# EAGLE design m328p_rfm69_node (EAGLE 7.2.0)
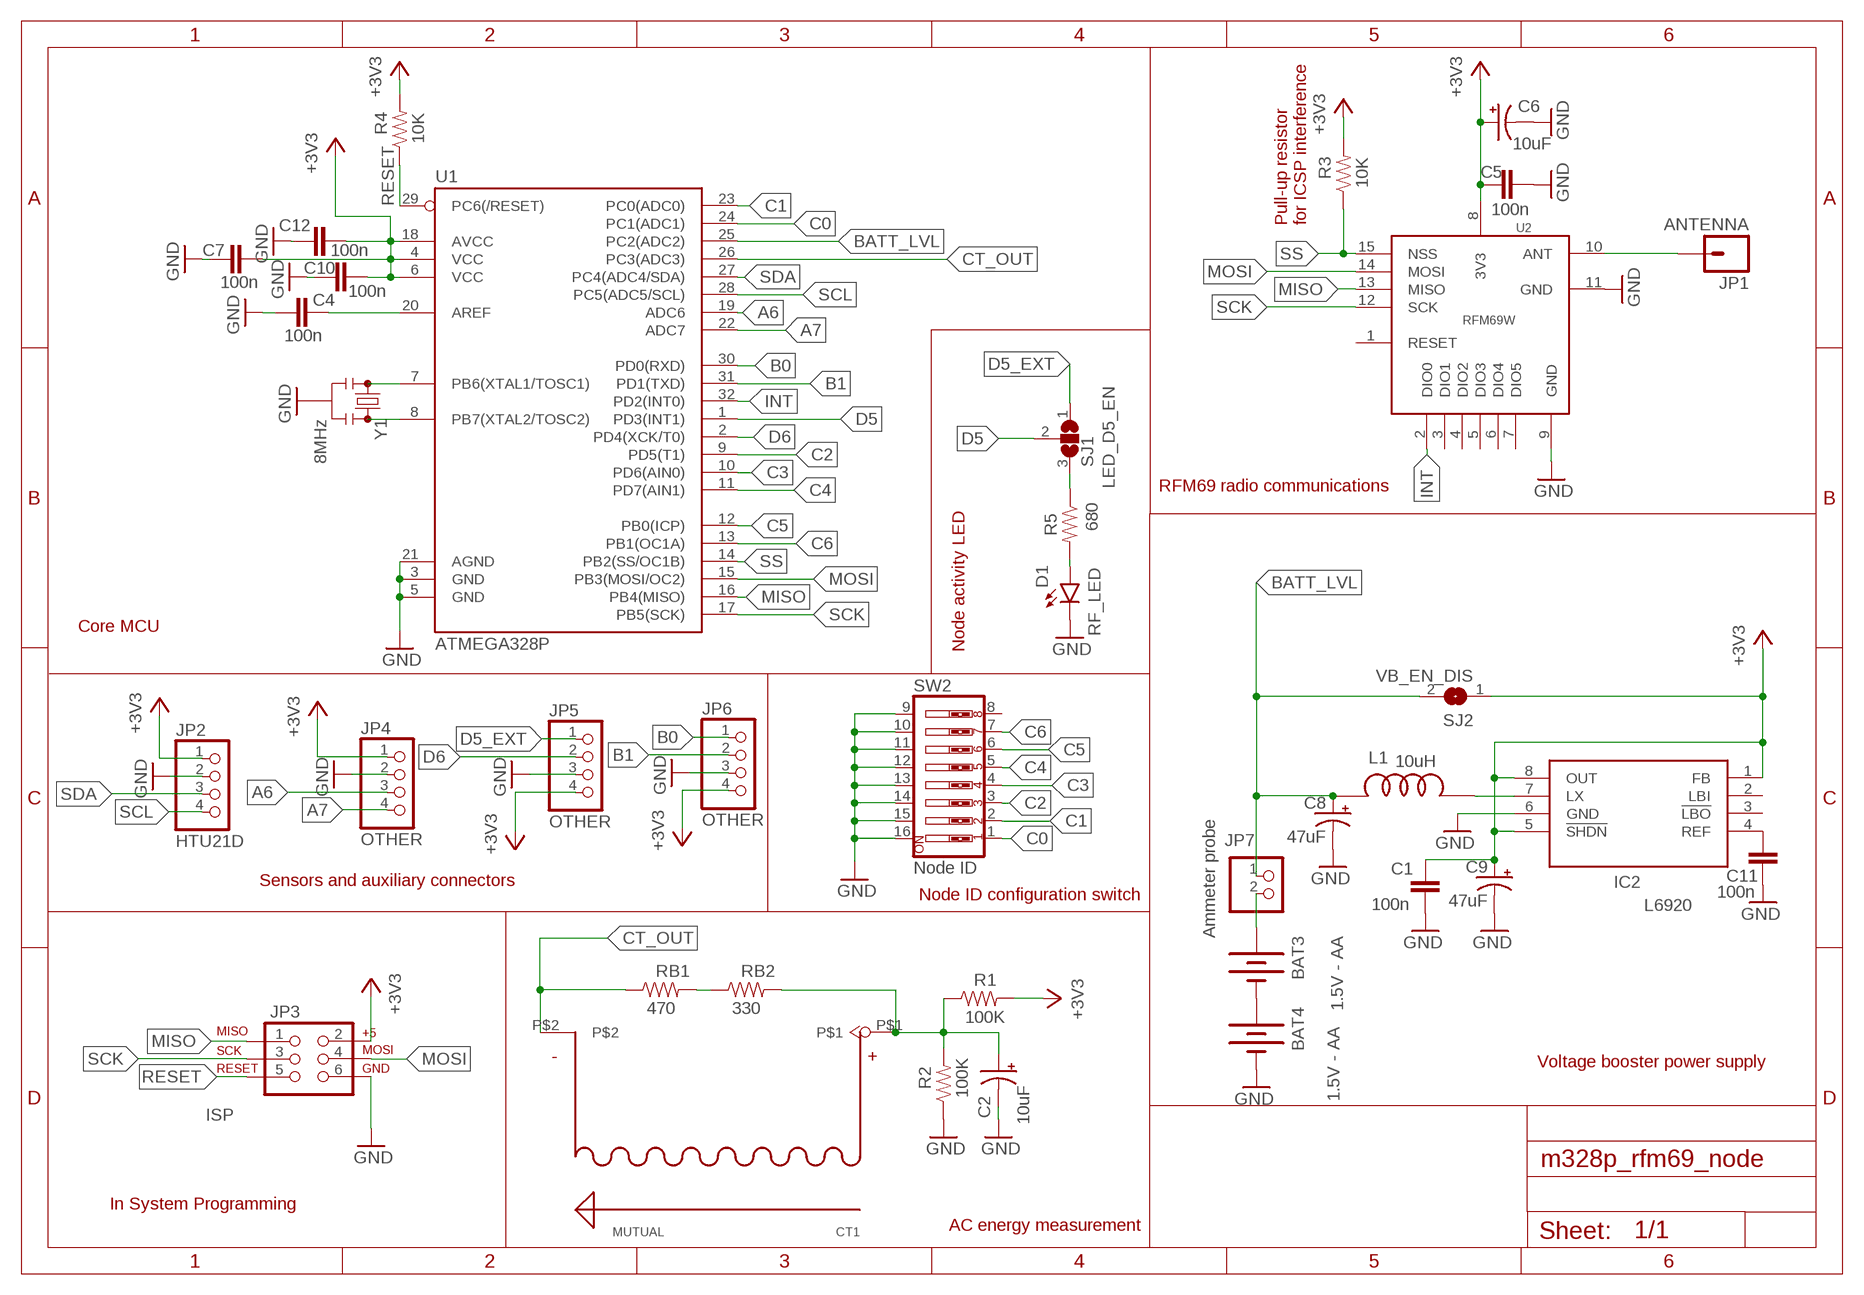
[diagram p0: schematic, sheet 1]

## Parts
BAT3  1.5V - AA  BATTERYAAA-KIT  [BATTERY-AAA-KIT]
BAT4  1.5V - AA  BATTERYAAA-KIT  [BATTERY-AAA-KIT]
C1  100n  CAP0805  [0805]
C2  10uF  47UF-TANT  [EIA3528]
C4  100n  CAP0805  [0805]
C5  100n  CAP0805  [0805]
C6  10uF  47UF-TANT  [EIA3528]
C7  100n  CAP0805  [0805]
C8  47uF  47UF-TANT  [EIA3528]
C9  47uF  47UF-TANT  [EIA3528]
C10  100n  CAP0805  [0805]
C11  100n  CAP0805  [0805]
C12  100n  CAP0805  [0805]
CT1  MUTUAL  [MUTUAL]
D1  RF_LED  LED0603  [LED-0603]
IC2  L6920  L6920TSSOP8  [TSSOP8]
JP1  ANTENNA  M01SMD  [LUXEON-PAD]
JP2  HTU21D  PINHD-1X4  [1X04]
JP3  ISP  AVR_SPI_PRG_6PTH  [2X3]
JP4  OTHER  PINHD-1X4  [1X04]
JP5  OTHER  PINHD-1X4  [1X04]
JP6  OTHER  PINHD-1X4  [1X04]
JP7  Ammeter probe  PINHD-1X2  [1X02]
L1  10uH  DLJ-4018  [DLJ-4018]
R1  100K  RESISTOR0805-RES  [0805]
R2  100K  RESISTOR0805-RES  [0805]
R3  10K  RESISTOR0805-RES  [0805]
R4  10K  RESISTOR0805-RES  [0805]
R5  680  RESISTOR0805-RES  [0805]
RB1  470  RESISTOR0805-RES  [0805]
RB2  330  RESISTOR0805-RES  [0805]
SJ1  LED_D5_EN  SJ2W  [SJ_2]
SJ2  VB_EN_DIS  SJ  [SJ]
SW2  Node ID  SW_DIP-8-SMT-HALFSIZE  [DIPSWITCH-08-50MIL]
U1  ATMEGA328P  ATMEGA328P_TQFP  [TQFP32-08]
U2  RFM69W  [RFM69W]
Y1  8MHz  RESONATOR4MHZ  [RESONATOR-SMD_MED]

## Nets
+3V3: C1.1 C5.1 C6.A(+) C7.2 C9.A(+) C10.2 C12.2 IC2.1(FB) IC2.5(!SHDN) IC2.8(OUT) JP2.1 JP3.2 JP4.1 JP5.4 JP6.4 R1.2 R3.2 R4.2 SJ2.1 U1.4(VCC) U1.6(VCC) U1.18(AVCC) U2.8(3V3)
A6: JP4.3 U1.19(ADC6)
A7: JP4.4 U1.22(ADC7)
B0: JP6.1 U1.30(PD0(RXD))
B1: JP6.2 U1.31(PD1(TXD))
BATT_LVL: C8.A(+) JP7.1 L1.P$2 SJ2.2 U1.25(PC2(ADC2))
C0: SW2.1 U1.24(PC1(ADC1))
C1: SW2.2 U1.23(PC0(ADC0))
C2: SW2.3 U1.9(PD5(T1))
C3: SW2.4 U1.10(PD6(AIN0))
C4: SW2.5 U1.11(PD7(AIN1))
C5: SW2.6 U1.12(PB0(ICP))
C6: SW2.7 U1.13(PB1(OC1A))
CT_OUT: CT1.P$2 RB1.1 U1.26(PC3(ADC3))
D5: SJ1.2 U1.1(PD3(INT1))
D5_EXT: JP5.1 SJ1.1
D6: JP5.2 U1.2(PD4(XCK/T0))
GND: BAT4.GND@1(-) C1.2 C2.C(-) C4.1 C5.2 C6.C(-) C7.1 C8.C(-) C9.C(-) C10.1 C11.2 C12.1 D1.C IC2.6(GND) JP2.2 JP3.6 JP4.2 JP5.3 JP6.3 R2.1 SW2.9 SW2.10 SW2.11 SW2.12 SW2.13 SW2.14 SW2.15 SW2.16 U1.3(GND) U1.5(GND) U1.21(AGND) U2.9(GND) U2.11(GND) Y1.2
INT: U1.32(PD2(INT0)) U2.2(DIO0)
MISO: JP3.1 U1.16(PB4(MISO)) U2.13(MISO)
MOSI: JP3.4 U1.15(PB3(MOSI/OC2)) U2.14(MOSI)
N$1: IC2.7(LX) L1.P$1
N$2: D1.A R5.2
N$3: RB1.2 RB2.1
N$4: C11.1 IC2.4(REF)
N$5: BAT3.PWR@1(+) JP7.2
N$6: U1.8(PB7(XTAL2/TOSC2)) Y1.3
N$8: BAT3.GND@1(-) BAT4.PWR@1(+)
N$9: U1.7(PB6(XTAL1/TOSC1)) Y1.1
N$10: JP1.P$1 U2.10(ANT)
N$11: C2.A(+) CT1.P$1 R1.1 R2.2 RB2.2
N$12: C4.2 U1.20(AREF)
N$13: R5.1 SJ1.3
RESET: JP3.5 R4.1 U1.29(PC6(/RESET))
SCK: JP3.3 U1.17(PB5(SCK)) U2.12(SCK)
SCL: JP2.4 U1.28(PC5(ADC5/SCL))
SDA: JP2.3 U1.27(PC4(ADC4/SDA))
SS: R3.1 U1.14(PB2(SS/OC1B)) U2.15(NSS)
Unconnected: IC2.2(LBI) IC2.3(!LBO) SW2.8 U2.1(RESET) U2.3(DIO1) U2.4(DIO2) U2.5(DIO3) U2.6(DIO4) U2.7(DIO5)

## Notes on the sheet
- Pull-up resistor
  for ICSP interference
- RFM69 radio communications
- Core MCU
- Node activity LED
- Sensors and auxiliary connectors
- Node ID configuration switch
- Voltage booster power supply
- In System Programming
- AC energy measurement

## Library data of the parts
BAT3 BAT4 = SparkFun-Electromechanical:BATTERY: Battery Holders Various common sizes : AA, AAA, 18650 (PRT-12895), 20mm coin cell and 12mm coin cell. 20MM_4LEGS, BATT-10373; PROD_ID: BATT-08571
C1 C4 C5 C7 C10-C12 = SparkFun-Capacitors:CAP: Capacitor Standard 0603 ceramic capacitor, and 0.1" leaded capacitor.
C2 C6 = SparkFun-Capacitors:47UF-TANT: 47uF Tantalum SMT CAP-08310- 10V 10% (EIA-3528); PROD_ID: CAP-08310; VALUE: 47uF
C8 C9 = SparkFun-Capacitors:47UF-TANT: 47uF Tantalum SMT CAP-08310- 10V 10% (EIA-3528); PROD_ID: CAP-08310
CT1 = Electricity_sensor:MUTUAL
D1 = SparkFun-LED:LED: LEDs Standard schematic elements and footprints for 5mm, 3mm, 1206, and 0603 sized LEDs. 5mm - Spark Fun Electronics SKU : COM-00529 (and others)
IC2 = l6920:L6920
JP1 = SparkFun-Connectors:M01: Header 1 Standard 1-pin 0.1" header. Use with straight break away headers (SKU : PRT-00116), right angle break away headers (PRT-00553), swiss pins (PRT-00743), machine pins (PRT-00117), and female headers (PRT-00115).
JP2 JP4-JP6 = pinhead:PINHD-1X4: PIN HEADER
JP3 = SparkFun-Connectors:AVR_SPI_PRG_6: AVR ISP 6 Pin This is the reduced ISP connector for AVR programming. Common on Arduino. This footprint will take up less PCB space and can be used with a 10-pin to 6-pin adapter such as SKU: BOB-08508 **Special note about "TEST_POINT" package. The stop mask is on the top side, so if you want your programming test points to be on the bottom of your board, make sure to place this package on the bottom side of the board. This also ensure that the orientation to program from the bottom side will be correct.
JP7 = pinhead:PINHD-1X2: PIN HEADER
L1 = dlj-4018:DLJ-4018
R1-R4 RB1 RB2 = SparkFun-Resistors:RESISTOR: Resistor Basic schematic elements and footprints for 0603, 1206, and PTH resistors.
R5 = SparkFun-Passives:RESISTOR: Resistor Basic schematic elements and footprints for 0603, 1206, and PTH resistors.
SJ1 = jumper:SJ2W: SMD solder JUMPER
SJ2 = jumper:SJ: SMD solder JUMPER
SW2 = SparkFun-Electromechanical:SW_DIP-8: DIP Switch 8 Position
U1 = SparkFun-DigitalIC:ATMEGA328P_TQFP; PROD_ID: IC-09069; VALUE: ATMEGA328P_TQFP
U2 = rfm69w:RFM69W: Radio Transceiver Module, FSK, 433, 848, 915 MHz, SPI controlled, Mfr=HopeRF
Y1 = SparkFun-FreqCtrl:RESONATOR: Resonator Small SMD resonator. Used, eg, on the Arduino Pro/ Pro Mini boards. 8MHz- XTAL-08895 16MHz- XTAL-08900; PROD_ID: XTAL-12492; VALUE: 4MHz

## Board
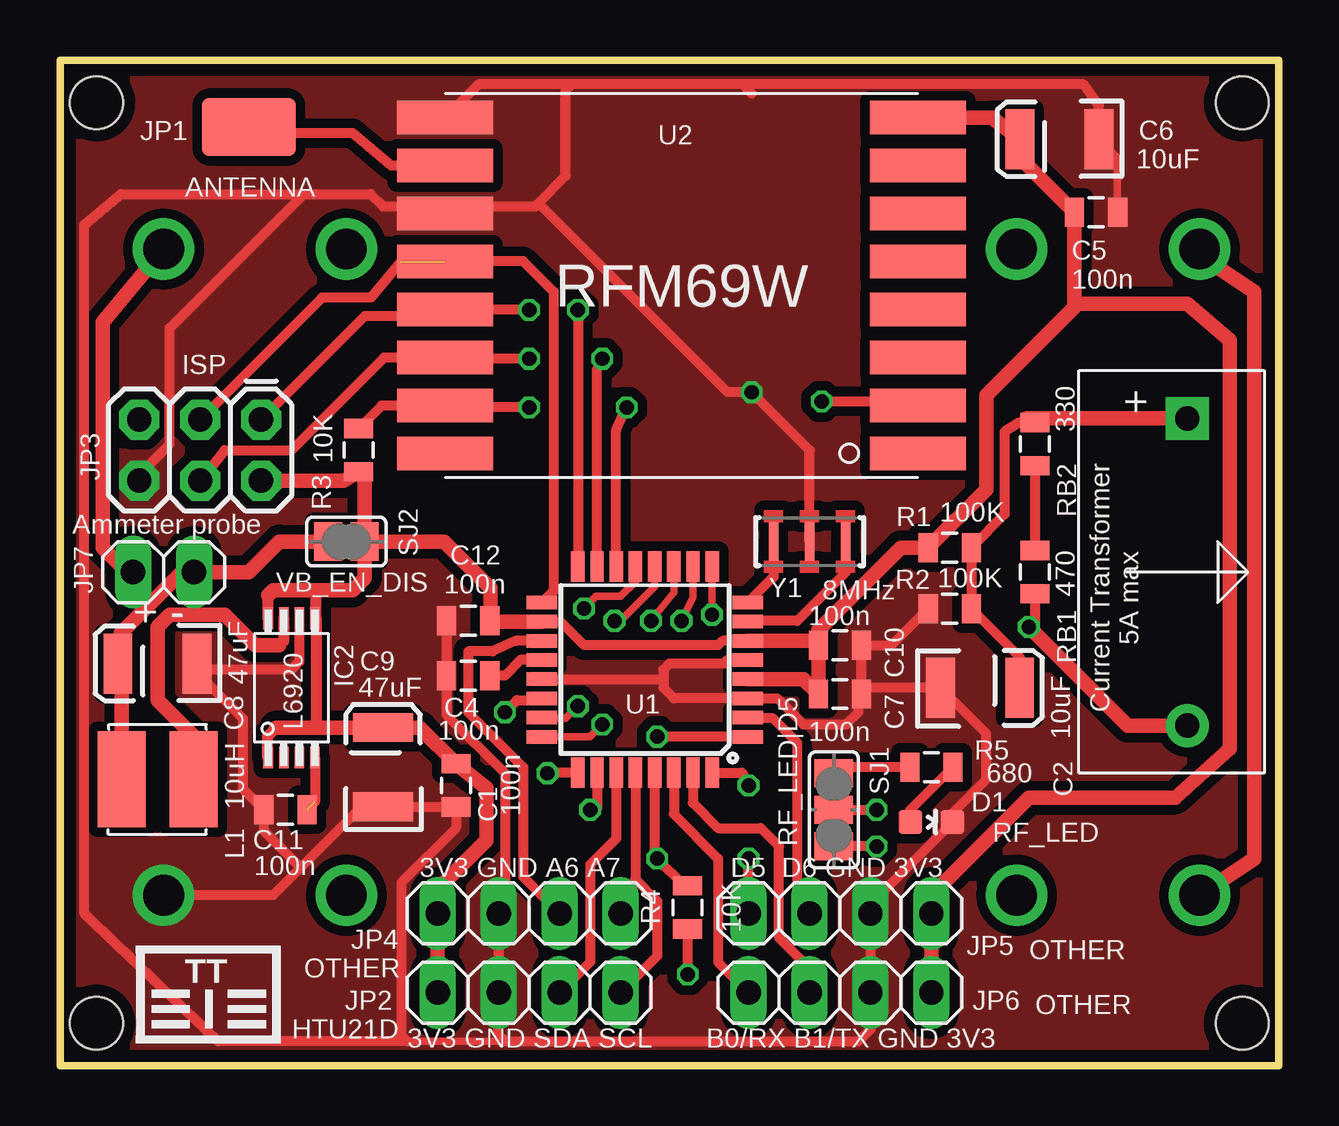
[diagram p1: board, top side]
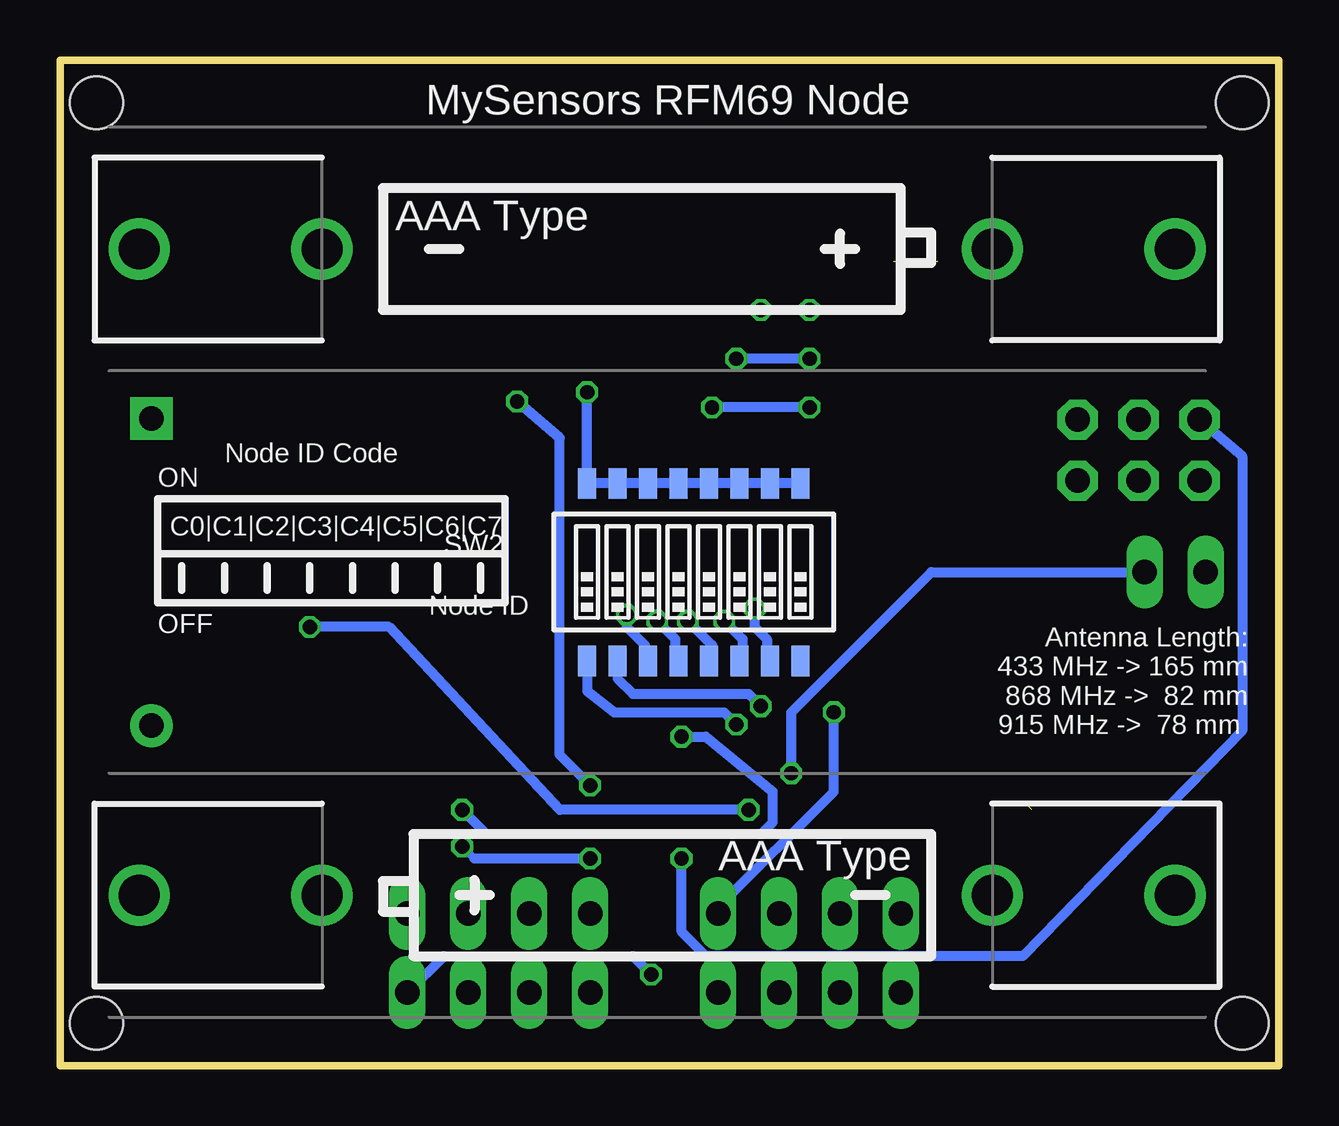
[diagram p2: board, bottom side, seen from below]

Size 50.8 x 41.91 mm. Coordinates in mm from the lower left corner, seen from the top.
Outline: 0,41.91 50.8,41.91 50.8,0 0,0 0,41.91
Copper layers (1*16): Top 0.035mm / dielectric 1.5mm / Bottom 0.035mm
Design rules "smart-proto *": minimum track width 7mil, minimum drill 12mil, track to track 7mil, track to pad 7mil, pad to pad 7mil, via to via 7mil, smd to smd 0mil, copper to edge 20mil, drill to drill 10mil, minimum pad ring 10mil, minimum via ring 6mil, stop-mask expansion 2mil, vias tented up to drill 25mil, thermal gap 10mil
Holes 2.2 mm at 1.52,40.13 1.52,1.78 49.28,1.78 49.28,40.13

### Footprints (pad centres in the part's own frame; a part is rotated, then mirrored left to right if it is on the bottom)
BATTERY-AAA-KIT = drill 1.702: GND@1 21.59,0; GND@2 13.97,0; PWR@1 -21.59,0; PWR@2 -13.97,0
0805 = smd 0.8 x 1.2: 1 -0.9,0; 2 0.9,0
EIA3528 = smd 1.2 x 2.5: A 1.65,0; C -1.65,0
MUTUAL = drill 1.016 pad 1.778 square: P$1 -6.4,0 | drill 1.016 pad 1.778: P$2 6.4,0
LED-0603 = smd 1 x 1: A 0,-0.877; C 0,0.877
TSSOP8 = smd 0.4 x 0.9: 1 -0.975,-2.9; 2 -0.325,-2.9; 3 0.325,-2.9; 4 0.975,-2.9; 5 0.975,2.9; 6 0.325,2.9; 7 -0.325,2.9; 8 -0.975,2.9
LUXEON-PAD = smd 3.9 x 2.4: P$1 0,0
1X04 = drill 1.016 long: 1 -3.81,0; 2 -1.27,0; 3 1.27,0; 4 3.81,0
2X3 = drill 1.016 pad 1.676 octagon: 1 -2.54,-1.27; 2 -2.54,1.27; 3 0,-1.27; 4 0,1.27; 5 2.54,-1.27; 6 2.54,1.27
1X02 = drill 1.016 long: 1 -1.27,0; 2 1.27,0
DLJ-4018 = smd 4 x 2: P$1 0,-1.5; P$2 0,1.5
SJ_2 = smd 1.168 x 1.6: 1 -1.524,0; 2 0,0; 3 1.524,0
SJ = smd 1.168 x 1.6: 1 -0.762,0; 2 0.762,0
DIPSWITCH-08-50MIL = smd 0.762 x 1.27: 1 -4.445,-3.7; 2 -3.175,-3.7; 3 -1.905,-3.7; 4 -0.635,-3.7; 5 0.635,-3.7; 6 1.905,-3.7; 7 3.175,-3.7; 8 4.445,-3.7; 9 4.445,3.7; 10 3.175,3.7; 11 1.905,3.7; 12 0.635,3.7; 13 -0.635,3.7; 14 -1.905,3.7; 15 -3.175,3.7; 16 -4.445,3.7
TQFP32-08 = smd 1.27 x 0.559: 1 -4.293,2.8; 2 -4.293,2; 3 -4.293,1.2; 4 -4.293,0.4; 5 -4.293,-0.4; 6 -4.293,-1.2; 7 -4.293,-2; 8 -4.293,-2.8; 17 4.293,-2.8; 18 4.293,-2; 19 4.293,-1.2; 20 4.293,-0.4; 21 4.293,0.4; 22 4.293,1.2; 23 4.293,2; 24 4.293,2.8 | smd 0.559 x 1.27: 9 -2.8,-4.293; 10 -2,-4.293; 11 -1.2,-4.293; 12 -0.4,-4.293; 13 0.4,-4.293; 14 1.2,-4.293; 15 2,-4.293; 16 2.8,-4.293; 25 2.8,4.293; 26 2,4.293; 27 1.2,4.293; 28 0.4,4.293; 29 -0.4,4.293; 30 -1.2,4.293; 31 -2,4.293; 32 -2.8,4.293
RFM69W = smd 4 x 1.4: 1 -9.85,7; 2 -9.85,5; 3 -9.85,3; 4 -9.85,1; 5 -9.85,-1; 6 -9.85,-3; 7 -9.85,-5; 8 -9.85,-7; 9 9.85,-7; 10 9.85,-5; 11 9.85,-3; 12 9.85,-1; 13 9.85,1; 14 9.85,3; 15 9.85,5; 16 9.85,7
RESONATOR-SMD_MED = smd 0.4 x 1.6: 1 -1.5,0; 2 0,0; 3 1.5,0

### Placement (x,y rotation side)
BAT3  25.91,34.04 180 bottom
BAT4  25.91,7.11 0 bottom
C1  16.51,11.68 270 top
C2  38.35,15.75 0 top
C4  17.02,16.26 0 top
C5  43.18,35.56 0 top
C6  41.66,38.61 180 top
C7  32.51,15.49 180 top
C8  4.06,16.76 180 top
C9  13.46,12.45 90 top
C10  32.51,17.53 180 top
C11  9.4,10.67 180 top
C12  17.02,18.54 0 top
CT1  46.99,20.57 270 top
D1  36.32,10.16 270 top
IC2  9.65,15.75 0 top
JP1  7.87,39.12 0 top
JP2  19.56,3.05 0 top
JP3  5.84,25.65 180 top
JP4  19.56,6.35 0 top
JP5  32.51,6.35 0 top
JP6  32.51,3.05 0 top
JP7  4.32,20.57 180 top
L1  4.06,11.94 90 top
R1  37.08,21.59 180 top
R2  37.08,19.05 0 top
R3  12.45,25.65 270 top
R4  26.16,6.6 270 top
R5  36.32,12.45 0 top
RB1  40.64,20.57 90 top
RB2  40.64,25.91 90 top
SJ1  32.26,10.67 90 top
SJ2  11.94,21.84 180 top
SW2  24.38,20.57 0 bottom
U1  24.38,16.51 180 top
U2  25.91,32.51 180 top
Y1  31.24,21.84 180 top

### Tracks (layer width: path | path; a pad name or v marks a point on that pad's centre or on a via)
+3V3  (via drill 0.6)
  Top 0.305: 17.95,18.51 C12.2 | 8.64,12.89 IC2.1 | 12.7,24.5 R3.2 | 10.67,14.35 10.41,14.1 | 10.67,18.69 IC2.5 | 31.61,18.15 C10.2 31.43,17.71 | 42.42,31.75 42.28,31.61
  Top 0.406: R4.2 v26.16,3.81 | U1.6 27.62,17.71 27.43,17.53 21.84,17.53 20.86,18.51 U1.18
  Top 0.457: 9.02,14.1 8.64,13.72 8.64,12.89 | IC2.8 8.68,19.6 | 10.67,14.35 10.67,18.69 10.67,19.81
  Top 0.61: U1.18 17.95,18.51 17.95,19.9 16,21.84 SJ2.1 | U1.4 31,16.11 C7.2 C10.2 | 9.02,14.1 10.41,14.1 C9.A 15,14.1 C1.1 17.78,11.57 17.78,9.4 15.75,7.37 JP4.1 JP2.1 | 8.68,19.6 8.89,19.81 10.67,19.81 12.19,19.81 12.7,20.32 SJ2.1 | SJ2.1 12.7,24.5 | JP3.2 11.82,24.38 R3.2 | 31.61,18.15 35.05,21.59 R1.2 38.61,24.01 38.61,27.94 42.28,31.61 C5.1 40.01,37.83 C6.A 38.85,39.51 U2.8 | 42.42,31.75 46.99,31.75 48.77,30.23 48.77,13.21 46.48,11.18 40.39,11.18 36.32,7.11 JP5.4 JP6.4 | U1.6 31.43,17.71
  Bottom 0.406: JP6.4 34.8,4.57 26.92,4.57 v26.16,3.81
A6
  Top 0.406: JP4.3 19.3,7.87 19.3,12.45 17.02,14.73 17.02,17.27 18.03,17.27 18.98,17.71 U1.19
A7  (via drill 0.6)
  Top 0.305: 20.02,15.24 U1.22
  Top 0.406: v18.54,14.73 19.05,15.24 20.02,15.24
  Bottom 0.305: JP4.4 23.37,6.6
  Bottom 0.406: 23.37,6.6 18.54,11.43 v18.54,14.73
B0
  Top 0.406: JP6.1 27.43,4.32 27.43,8.64 25.58,10.48 U1.30
B1
  Top 0.406: U1.31 26.38,10.95 27.43,9.91 29.21,9.91 29.97,9.14 29.97,5.33 31.24,4.06 JP6.2
BATT_LVL  (via drill 0.6)
  Top 0.305: 2.56,16.61 C8.A 2.54,16.89 2.54,18.03 | 20.35,12.22 v20.32,12.19
  Top 0.406: U1.25 20.35,12.22
  Top 0.61: L1.P$2 2.56,16.61 | SJ2.2 9.14,21.84 7.87,20.57 JP7.1 5.08,20.57 2.54,18.03
  Bottom 0.406: v20.32,12.19 20.32,14.73 14.48,20.57 JP7.1
C0  (via drill 0.6)
  Top 0.305: U1.24 22.1,13.72 v22.61,14.22
  Bottom 0.406: SW2.1 28.83,15.62 27.69,14.73 23.11,14.73 v22.61,14.22
C1  (via drill 0.6)
  Top 0.305: U1.23 20.12,14.48 21.08,14.48 v21.59,14.99
  Bottom 0.406: SW2.2 27.56,16.13 26.92,15.49 22.1,15.49 v21.59,14.99
C2  (via drill 0.6)
  Top 0.305: U1.9 27.18,19.06 v27.18,18.8
  Bottom 0.305: 26.42,17 SW2.3
  Bottom 0.406: v27.18,18.8 27.18,18.29 26.42,17.53 26.42,17
C3  (via drill 0.6)
  Top 0.305: U1.10 26.38,19.53 v25.91,18.54
  Bottom 0.305: 25.15,17 SW2.4
  Bottom 0.406: 25.15,17 25.15,17.78 v25.91,18.54
C4  (via drill 0.6)
  Top 0.305: U1.11 25.58,19.74 v24.64,18.54
  Bottom 0.305: 23.62,17 SW2.5
  Bottom 0.406: 23.62,17 23.62,17.53 v24.64,18.54
C5  (via drill 0.6)
  Top 0.305: U1.12 24.78,19.96 23.37,18.54 v23.11,18.54
  Bottom 0.305: 22.35,17 SW2.6
  Bottom 0.406: v23.11,18.54 22.35,17.78 22.35,17
C6  (via drill 0.6)
  Top 0.305: U1.13 23.98,20.17 23.37,19.56 22.35,19.56 v21.84,19.05
  Bottom 0.305: 21.34,17 SW2.7
  Bottom 0.406: v21.84,19.05 21.84,18.29 21.34,17.78 21.34,17
CT_OUT  (via drill 0.6)
  Top 0.305: 40.64,18.54 v40.39,18.29
  Top 0.406: U1.26 22.38,10.7 v22.1,10.67 | RB1.1 40.64,18.54
  Top 0.61: CT1.P$2 44.5,14.17 v40.39,18.29
  Bottom 0.406: v22.1,10.67 29.97,10.67 37.08,18.29 v40.39,18.29
D5  (via drill 0.6)
  Top 0.406: SJ1.2 v34.04,10.67 | U1.1 v24.9,13.71 v24.89,13.72
  Bottom 0.406: v34.04,10.67 33.02,9.65 21.59,9.65 21.08,10.16 21.08,11.43 23.88,13.72 v24.89,13.72
D5_EXT  (via drill 0.6)
  Top 0.406: JP5.1 v28.7,8.64 | v34.04,9.14 SJ1.1
  Bottom 0.305: 33.53,8.64 v34.04,9.14
  Bottom 0.406: v28.7,8.64 33.53,8.64
D6
  Top 0.305: 28.71,14.48 U1.2
  Top 0.406: JP5.2 31.24,6.86 30.73,7.37 30.73,13.46 29.72,14.48 28.71,14.48
GND  (via drill 0.6)
  Top 0.254: JP3.6 3.3,24.64 | 10.16,36.32 10.67,36.32
  Top 0.305: 16.01,10.8 C1.2 | C11.2 8.5,10.3 | C8.C 5.71,16.38 | 14.99,35.81 U2.11 16.26,35.81 | 25.04,16.11 25.15,16 | JP5.3 33.78,6.74 | D1.C 37.2,10.53 | 33.67,15.75 C7.1 33.27,15.36 | C5.2 44.08,37.83 C6.C | 18.54,1.02 14.48,1.02
  Top 0.406: C12.1 C4.1 16.12,14.62 18.54,12.19 18.54,6.6 JP4.2 JP2.2 18.29,1.27 18.54,1.02 33.27,1.02 33.78,1.52 JP6.3 JP5.3 | C7.1 C10.1 34.66,17.53 R2.1 | 16.01,10.8 C9.C 12.57,10.8 10.03,8.26 | BAT4.GND@1 8.89,7.11 10.03,8.26 | IC2.6 9.98,16.84 9.65,16.51 5.97,16.51 C8.C | 5.71,16.38 7.62,14.48 7.62,11.55 C11.2 | 14.99,35.81 13.46,35.81 12.95,36.32 10.67,36.32 2.54,36.32 1.02,35.05 1.02,6.35 6.6,1.02 14.48,1.02 14.22,1.27 14.22,7.62 16.51,9.91 C1.2 | U1.21 25.04,16.11 | 33.78,6.74 D1.C | 37.2,10.53 38.61,11.94 38.61,13.84 C2.C 33.67,15.75 | 33.27,15.36 33.27,14.73 32.77,14.22 30.99,14.22 29.9,15.31 U1.3 25.58,15.31 25.15,15.75 25.15,16 25.15,16.51 25.4,16.76 27.69,16.76 27.83,16.91 U1.5 | C6.C 43.31,40.01 42.67,40.89 28.45,40.89 | 28.45,40.89 21.34,40.89 | 21.34,40.89 17.44,40.89 U2.9 | Y1.2 31.24,25.65 v28.83,28.07 27.81,28.07 19.94,35.94 | 3.3,24.64 4.57,25.91 4.57,30.73 10.16,36.32 | 8.5,10.3 8.5,9.79 10.03,8.26 | 28.83,40.51 28.45,40.89 | 16.26,35.81 19.81,35.81 19.94,35.94 | 19.94,35.94 21.08,37.08 21.08,40.64 21.34,40.89
  Bottom 0.406: SW2.9 SW2.10 SW2.11 SW2.12 SW2.13 SW2.14 SW2.15 SW2.16 v28.83,28.07
  pour Top (isolate 0.406, no thermals): 0,41.91 50.8,41.91 50.8,0 0,0
INT  (via drill 0.6)
  Top 0.305: 35.17,27.69 U2.2
  Top 0.406: U1.32 28.42,12.22 v28.7,11.68 | v31.75,27.69 35.17,27.69
  Bottom 0.406: v28.7,11.68 29.97,12.95 29.97,26.16 v31.75,27.69
MISO  (via drill 0.6)
  Top 0.305: 16.33,31.5 U2.13 15.79,31.24 | U1.16
  Top 0.406: v19.56,31.5 16.33,31.5 | v21.59,31.5 U1.16 | 15.79,31.24 12.7,31.24 JP3.1
  Bottom 0.406: v21.59,31.5 v19.56,31.5
MOSI  (via drill 0.6)
  Top 0.305: 16.11,29.46 U2.14
  Top 0.406: JP3.4 6.86,25.65 9.65,25.65 13.51,29.51 U2.14 | v19.56,29.46 16.11,29.46 | U1.15 22.38,28.99 v22.61,29.46
  Bottom 0.406: v19.56,29.46 v22.61,29.46
N$1
  Top 0.305: 5.59,13.72 5.59,11.96 L1.P$1
  Top 0.457: IC2.7 9.33,17.71 9.14,17.53
  Top 0.61: 9.14,17.53 8.13,17.53 6.86,18.8 4.57,18.8 4.06,18.29 4.06,15.24 5.59,13.72
N$2
  Top 0.406: D1.A 35.45,10.67 R5.2
N$3
  Top 0.406: RB2.1 RB1.2
N$4  (1 unrouted)
  Top 0.406: IC2.4 10.63,11
N$5
  Top 0.305: JP7.2 2.79,20.57
  Top 0.61: 2.79,20.57 1.78,21.59 1.78,30.99 BAT3.PWR@1
N$6
  Top 0.406: Y1.3 29.74,20.38 U1.8
N$8
  Top 0.305: BAT3.GND@1 47.5,33.78
  Top 0.61: 47.5,33.78 49.78,32.26 49.78,8.64 BAT4.PWR@1
N$9
  Top 0.305: 28.71,18.54 U1.7
  Top 0.406: Y1.1 32.74,20.55 30.73,18.54 28.71,18.54
N$10
  Top 0.305: 8.13,38.86 JP1.P$1
  Top 0.406: U2.10 13.8,37.51 12.19,38.86 8.13,38.86
N$11
  Top 0.305: 40.3,26.97 RB2.2 40.02,26.81 | C2.A 40,17.03
  Top 0.406: 40,17.03 R2.2 R1.1 39.37,22.98 39.37,26.42 40.02,26.81
  Top 0.61: CT1.P$1 40.3,26.97
N$12
  Top 0.406: U1.20 19.2,16.91 18.54,16.26 C4.2
N$13
  Top 0.305: 32.26,12.45 SJ1.3
  Top 0.406: R5.1 32.26,12.45
RESET  (via drill 0.6)
  Top 0.406: U1.29 24.78,8.74 v24.89,8.64 26.02,7.5 R4.1
  Bottom 0.406: v24.89,8.64 24.89,5.59 23.88,4.57 10.67,4.57 1.52,13.97 1.52,25.4 JP3.5
SCK  (1 unrouted)
  Top 0.305: 16.58,33.53 U2.12
  Top 0.406: 16.58,33.53 19.3,33.53 20.57,32.26 20.57,19.79 U1.17 | 14.21,33.51 12.95,32 10.92,32 JP3.3
SCL
  Top 0.406: U1.28 23.98,7.77 24.89,6.86 24.89,4.57 JP2.4
SDA
  Top 0.406: U1.27 23.18,9.47 22.1,8.38 22.1,4.32 JP2.3
SS  (via drill 0.6)
  Top 0.305: 16.14,27.43 U2.15
  Top 0.406: U2.15 13.4,27.51 R3.1 | v19.56,27.43 16.14,27.43 | U1.14 23.18,26.49 v23.62,27.43
  Bottom 0.406: v19.56,27.43 v23.62,27.43

### Text on the board
tPlace: + - | Current Transformer / 5A max | RF_LED|D5 | 3V3 GND A6 A7 | D5 D6 GND 3V3 | TT | 3V3 GND SDA SCL | B0/RX B1/TX GND 3V3
bPlace: MySensors RFM69 Node | AAA Type | Node ID Code | ON | C0|C1|C2|C3|C4|C5|C6|C7 | Antenna Length: / 433 MHz -> 165 mm / 868 MHz -> 82 mm / 915 MHz -> 78 mm | OFF | AAA Type